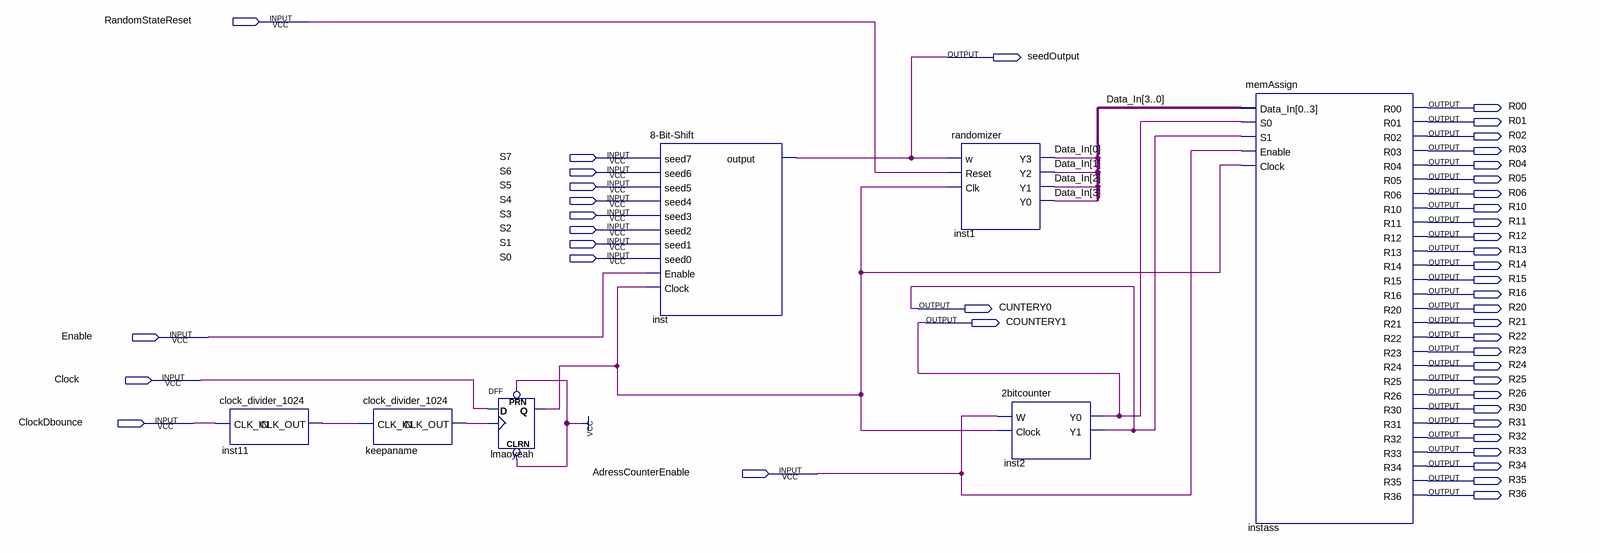
[diagram p0: schematic sheet]
// Quartus schematic Psuedo_Random_Generator.bdf as structural Verilog: 7 symbols, 44 pins
module Psuedo_Random_Generator (
  input  RandomStateReset,
  input  S7,
  input  S6,
  input  S5,
  input  S4,
  input  S3,
  input  S2,
  input  S1,
  input  S0,
  input  Enable,
  input  Clock,
  input  ClockDbounce,
  input  AdressCounterEnable,
  output seedOutput,
  output R00,
  output R01,
  output R02,
  output R03,
  output R04,
  output R05,
  output R06,
  output R10,
  output R11,
  output R12,
  output R13,
  output R14,
  output R15,
  output R16,
  output CUNTERY0,
  output R20,
  output COUNTERY1,
  output R21,
  output R22,
  output R23,
  output R24,
  output R25,
  output R26,
  output R30,
  output R31,
  output R32,
  output R33,
  output R34,
  output R35,
  output R36
);

  wire inst11_clk_out, keepaname_clk_out, lmaoyeah_q;
  wire [3:0] Data_In;

  clock_divider_1024 inst11 (.CLK_IN(ClockDbounce), .CLK_OUT(inst11_clk_out));
  clock_divider_1024 keepaname (.CLK_IN(inst11_clk_out), .CLK_OUT(keepaname_clk_out));
  DFF lmaoyeah (.CLRN(1'b1), .CLK(keepaname_clk_out), .D(Clock), .PRN(1'b1), .Q(lmaoyeah_q));
  \8-Bit-Shift  inst (
    .seed7(S7), .seed6(S6), .seed5(S5), .seed4(S4), .seed3(S3), .seed2(S2), .seed1(S1), .seed0(S0),
    .Enable(Enable), .Clock(lmaoyeah_q), .\output (seedOutput));
  randomizer inst1 (
    .w(seedOutput), .Reset(RandomStateReset), .Clk(lmaoyeah_q), .Y3(Data_In[0]), .Y2(Data_In[1]),
    .Y1(Data_In[2]), .Y0(Data_In[3]));
  \2bitcounter  inst2 (.W(AdressCounterEnable), .Clock(lmaoyeah_q), .Y0(COUNTERY1), .Y1(CUNTERY0));
  memAssign instass (
    .Data_In(Data_In), .S0(COUNTERY1), .S1(CUNTERY0), .Enable(AdressCounterEnable), .Clock(lmaoyeah_q),
    .R00(R00), .R01(R01), .R02(R02), .R03(R03), .R04(R04), .R05(R05), .R06(R06), .R10(R10), .R11(R11),
    .R12(R12), .R13(R13), .R14(R14), .R15(R15), .R16(R16), .R20(R20), .R21(R21), .R22(R22), .R23(R23),
    .R24(R24), .R25(R25), .R26(R26), .R30(R30), .R31(R31), .R32(R32), .R33(R33), .R34(R34), .R35(R35),
    .R36(R36));
endmodule
